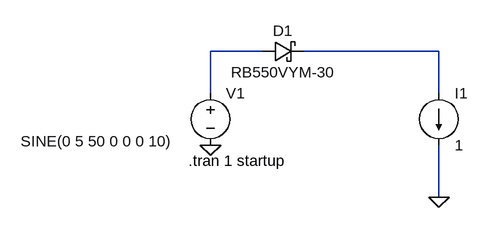
[diagram p0: schematic 01 Half wave rectifier .asc]
01 Half wave rectifier .asc, the LTspice schematic file:
Version 4
SHEET 1 880 680
WIRE 112 128 32 128
WIRE 384 128 176 128
WIRE 32 192 32 128
WIRE 384 192 384 128
WIRE 384 352 384 272
FLAG 384 352 0
FLAG 32 272 0
SYMBOL schottky 112 144 R270
WINDOW 0 32 32 VTop 2
WINDOW 3 0 32 VBottom 2
SYMATTR InstName D1
SYMATTR Value RB550VYM-30
SYMATTR Description Diode
SYMATTR Type diode
SYMBOL voltage 32 176 R0
WINDOW 3 -292 90 Left 2
WINDOW 123 0 0 Left 0
WINDOW 39 0 0 Left 0
SYMATTR InstName V1
SYMATTR Value SINE(0 5 50 0 0 0 10)
SYMBOL current 384 192 R0
WINDOW 123 0 0 Left 0
WINDOW 39 0 0 Left 0
SYMATTR InstName I1
SYMATTR Value 1
TEXT -2 296 Left 2 !.tran 1 startup

The netlist it stands for:
* 01 Half wave rectifier .asc
D1 N001 N002 RB550VYM-30
V1 N001 0 SINE(0 5 50 0 0 0 10)
I1 N002 0 1
.model D D
.lib standard.dio
.tran 1 startup
.backanno
.end